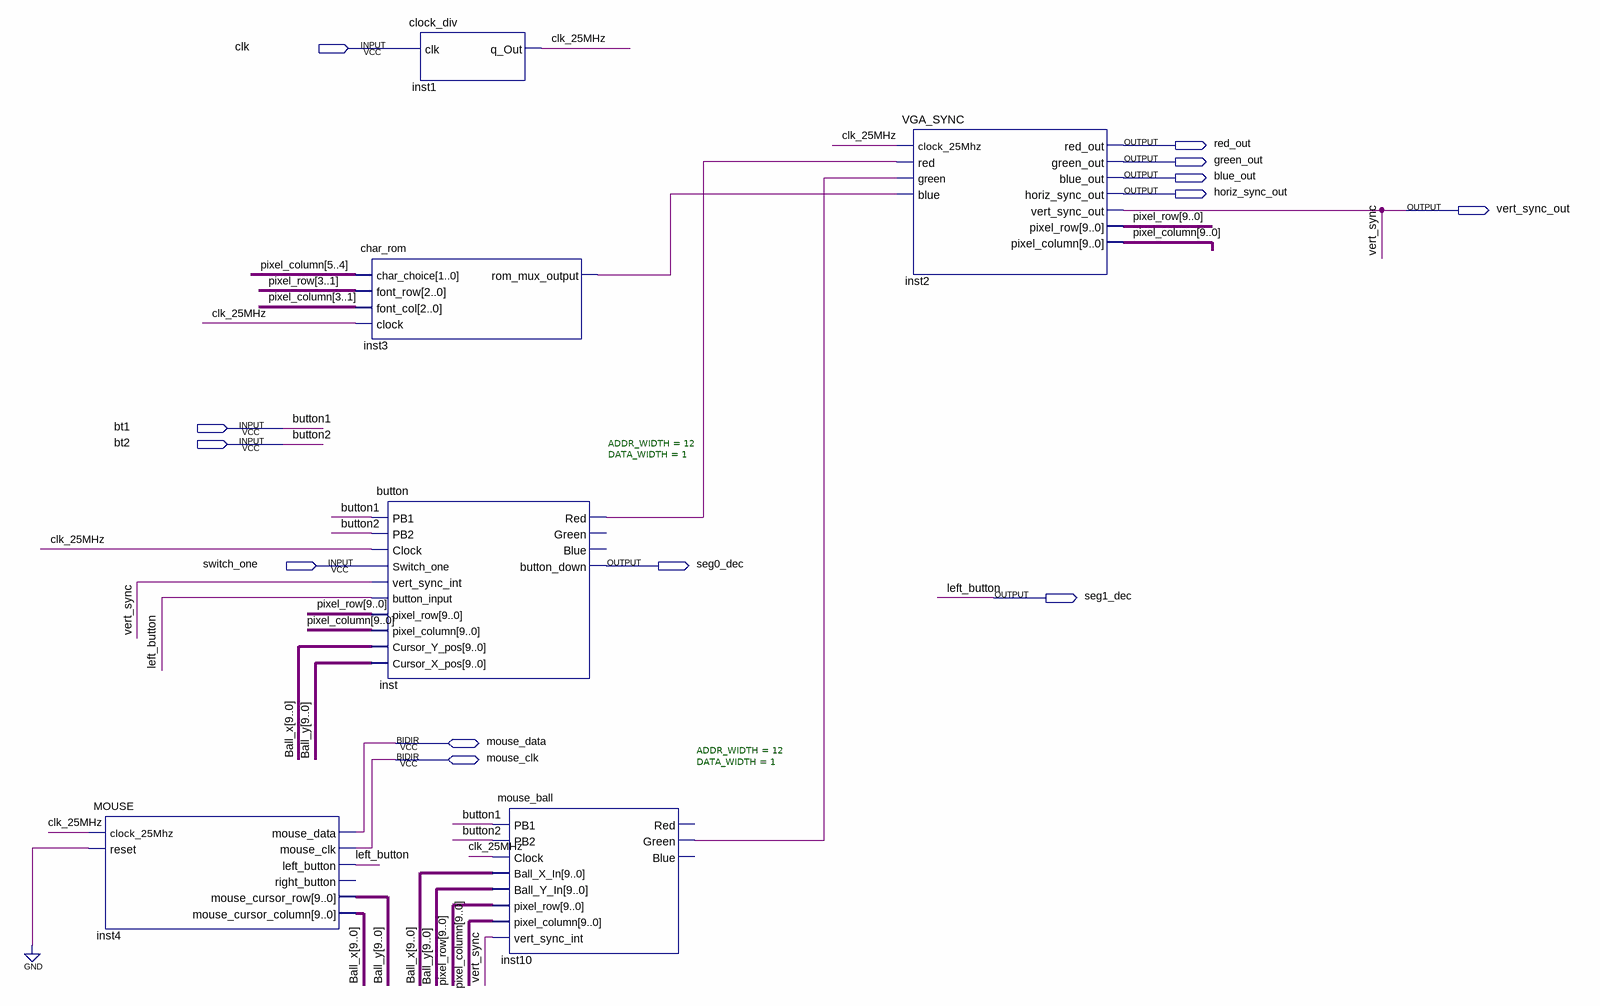
[diagram p0: schematic sheet]
// Quartus schematic buttontest.bdf as structural Verilog: 6 symbols, 13 pins
module buttontest (
  input  clk,
  input  bt1,
  input  bt2,
  input  switch_one,
  inout  mouse_data,
  inout  mouse_clk,
  output red_out,
  output green_out,
  output blue_out,
  output horiz_sync_out,
  output vert_sync_out,
  output seg0_dec,
  output seg1_dec
);

  wire clk_25MHz, inst3_rom_mux_output, inst10_green, inst_red;
  wire [9:0] Ball_x, Ball_y, pixel_column, pixel_row;

  MOUSE inst4 (
    .clock_25Mhz(clk_25MHz), .reset(1'b0), .left_button(seg1_dec), .mouse_cursor_row(Ball_y),
    .mouse_cursor_column(Ball_x), .mouse_data(mouse_data), .mouse_clk(mouse_clk));  // open: right_button
  char_rom inst3 (
    .char_choice(pixel_column[5:4]), .font_row(pixel_row[3:1]), .font_col(pixel_column[3:1]),
    .clock(clk_25MHz), .rom_mux_output(inst3_rom_mux_output));
  button #(.ADDR_WIDTH(12), .DATA_WIDTH(1)) inst (
    .PB1(bt1), .PB2(bt2), .Clock(clk_25MHz), .Switch_one(switch_one), .vert_sync_int(vert_sync_out),
    .button_input(seg1_dec), .pixel_row(pixel_row), .pixel_column(pixel_column), .Cursor_Y_pos(Ball_x),
    .Cursor_X_pos(Ball_y), .Red(inst_red), .button_down(seg0_dec));  // open: Green, Blue
  clock_div inst1 (.clk(clk), .q_Out(clk_25MHz));
  mouse_ball #(.ADDR_WIDTH(12), .DATA_WIDTH(1)) inst10 (
    .PB1(bt1), .PB2(bt2), .Clock(clk_25MHz), .Ball_X_In(Ball_x), .Ball_Y_In(Ball_y), .pixel_row(pixel_row),
    .pixel_column(pixel_column), .vert_sync_int(vert_sync_out), .Green(inst10_green));  // open: Red, Blue
  VGA_SYNC inst2 (
    .clock_25Mhz(clk_25MHz), .red(inst_red), .green(inst10_green), .blue(inst3_rom_mux_output),
    .red_out(red_out), .green_out(green_out), .blue_out(blue_out), .horiz_sync_out(horiz_sync_out),
    .vert_sync_out(vert_sync_out), .pixel_row(pixel_row), .pixel_column(pixel_column));

  // Other names for the same wires on the sheet: button1 = bt1; button2 = bt2; left_button = seg1_dec;
  //   vert_sync = vert_sync_out
endmodule
